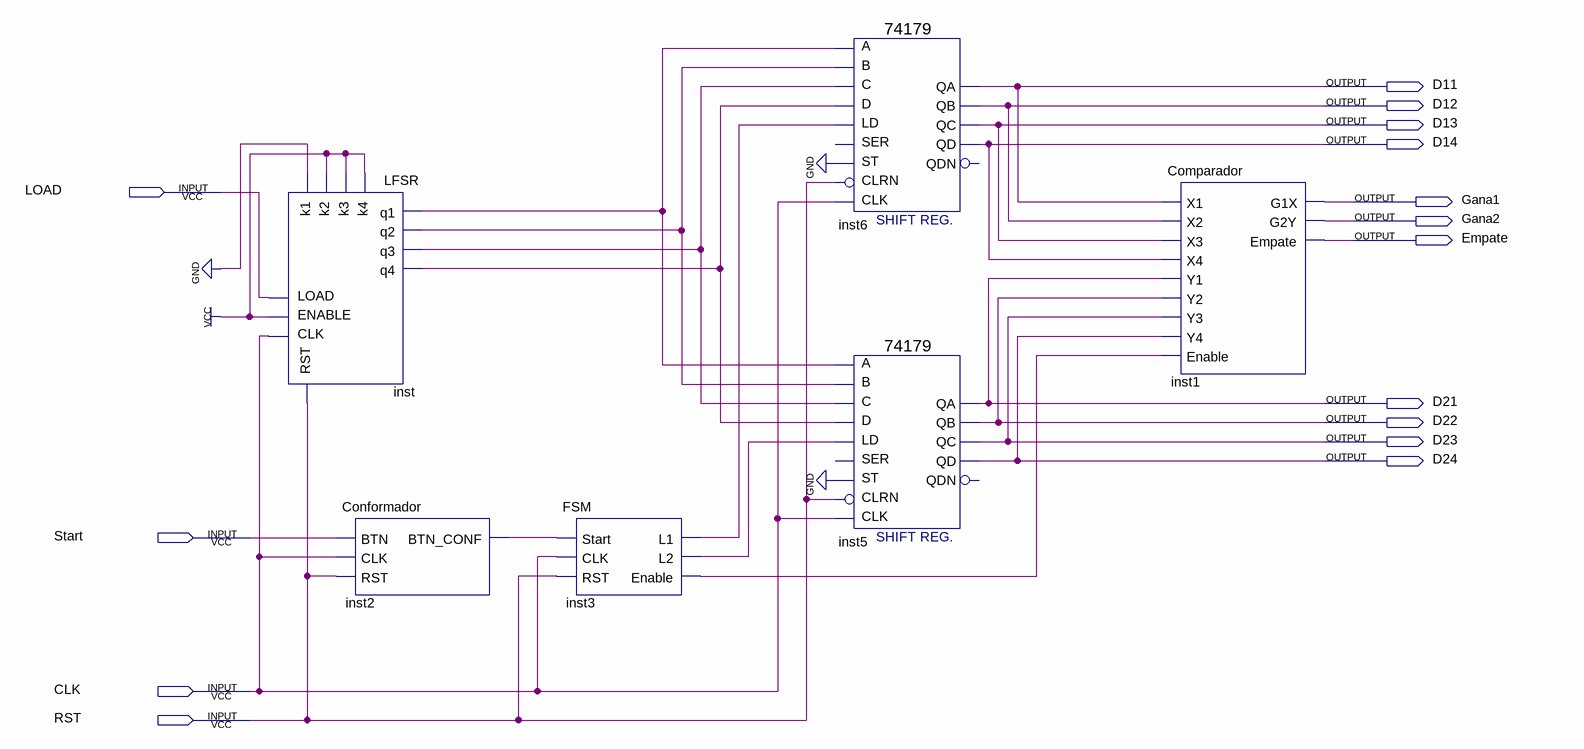
[diagram p0: schematic sheet]
// Quartus schematic JuegoDados.bdf as structural Verilog: 6 symbols, 15 pins
module JuegoDados (
  input  LOAD,
  input  Start,
  input  CLK,
  input  RST,
  output D11,
  output D12,
  output D13,
  output D14,
  output Gana1,
  output Gana2,
  output Empate,
  output D21,
  output D22,
  output D23,
  output D24
);

  wire inst2_btn_conf, inst3_enable, inst3_l1, inst3_l2, inst_q1, inst_q2, inst_q3, inst_q4;

  LFSR inst (
    .k1(1'b0), .k2(1'b1), .k3(1'b1), .k4(1'b1), .LOAD(LOAD), .CLK(CLK), .ENABLE(1'b1), .RST(RST),
    .q1(inst_q1), .q2(inst_q2), .q3(inst_q3), .q4(inst_q4));
  Conformador inst2 (.BTN(Start), .CLK(CLK), .RST(RST), .BTN_CONF(inst2_btn_conf));
  FSM inst3 (.Start(inst2_btn_conf), .CLK(CLK), .RST(RST), .L1(inst3_l1), .L2(inst3_l2), .Enable(inst3_enable));
  \74179  inst6 (
    .A(inst_q1), .B(inst_q2), .LD(inst3_l1), .D(inst_q4), .C(inst_q3), .CLRN(RST), .ST(1'b0), .CLK(CLK),
    .QD(D14), .QB(D12), .QC(D13), .QA(D11));  // open: SER, QDN
  \74179  inst5 (
    .A(inst_q1), .B(inst_q2), .LD(inst3_l2), .D(inst_q4), .C(inst_q3), .CLRN(RST), .ST(1'b0), .CLK(CLK),
    .QD(D24), .QB(D22), .QC(D23), .QA(D21));  // open: SER, QDN
  Comparador inst1 (
    .X1(D11), .X2(D12), .X3(D13), .X4(D14), .Y1(D21), .Y2(D22), .Y3(D23), .Y4(D24), .Enable(inst3_enable),
    .G1X(Gana1), .G2Y(Gana2), .Empate(Empate));
endmodule
